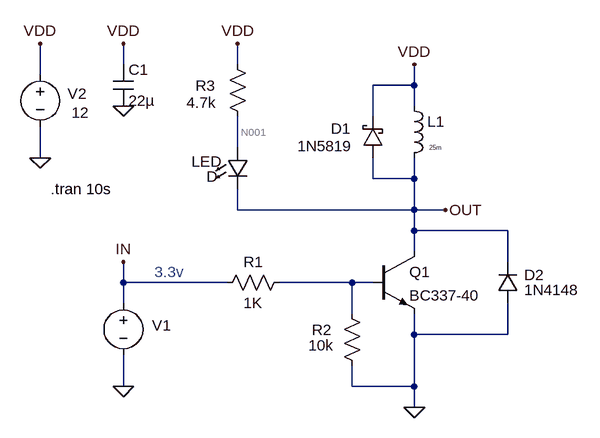
[diagram p0: schematic v1.1.asc]
v1.1.asc, the LTspice schematic file:
Version 4.1
SHEET 1 1332 680
WIRE 336 -112 336 -144
WIRE 512 -112 512 -144
WIRE 208 -96 208 -144
WIRE 784 -80 784 -112
WIRE 784 -80 720 -80
WIRE 784 -48 784 -80
WIRE 720 -32 720 -80
WIRE 512 16 512 -32
WIRE 208 32 208 -16
WIRE 720 64 720 32
WIRE 784 64 784 32
WIRE 784 64 720 64
WIRE 512 112 512 80
WIRE 784 112 784 64
WIRE 784 112 512 112
WIRE 832 112 784 112
WIRE 784 144 784 112
WIRE 928 144 784 144
WIRE 784 176 784 144
WIRE 928 192 928 144
WIRE 336 224 336 192
WIRE 496 224 336 224
WIRE 688 224 576 224
WIRE 720 224 688 224
WIRE 336 256 336 224
WIRE 688 272 688 224
WIRE 784 304 784 272
WIRE 928 304 928 256
WIRE 928 304 784 304
WIRE 336 384 336 336
WIRE 688 384 688 352
WIRE 784 384 784 304
WIRE 784 384 688 384
WIRE 784 416 784 384
FLAG 336 384 0
FLAG 208 32 0
FLAG 336 192 IN
FLAG 784 416 0
FLAG 208 -144 VDD
FLAG 784 -112 VDD
FLAG 832 112 OUT
FLAG 512 -144 VDD
FLAG 336 -48 0
FLAG 336 -144 VDD
SYMBOL voltage 336 240 R0
WINDOW 123 0 0 Left 0
WINDOW 39 0 0 Left 0
WINDOW 0 44 50 Left 2
WINDOW 3 43 83 Invisible 2
SYMATTR InstName V1
SYMATTR Value PULSE(0 3.3 2 1n 1n 2 4)
SYMBOL res 592 208 R90
WINDOW 0 0 56 VBottom 2
WINDOW 3 32 56 VTop 2
SYMATTR InstName R1
SYMATTR Value 1K
SYMBOL voltage 208 -112 R0
WINDOW 123 0 0 Left 0
WINDOW 39 0 0 Left 0
WINDOW 0 42 45 Left 2
WINDOW 3 48 74 Left 2
SYMATTR InstName V2
SYMATTR Value 12
SYMBOL npn 720 176 R0
SYMATTR InstName Q1
SYMATTR Value BC337-40
SYMBOL res 672 256 R0
WINDOW 0 -46 41 Left 2
WINDOW 3 -51 65 Left 2
SYMATTR InstName R2
SYMATTR Value 10k
SYMBOL ind 768 -64 R0
WINDOW 3 39 80 Left 0
SYMATTR Value 25m
SYMATTR InstName L1
SYMATTR SpiceLine Rser=120
SYMBOL diode 944 256 R180
WINDOW 0 -40 44 Left 2
WINDOW 3 -94 21 Left 2
SYMATTR InstName D2
SYMATTR Value 1N4148
SYMBOL LED 496 16 R0
WINDOW 0 -55 22 Left 2
WINDOW 3 -32 45 Left 2
SYMATTR InstName LED
SYMBOL res 496 -128 R0
WINDOW 0 -49 49 Left 2
WINDOW 3 -63 75 Left 2
SYMATTR InstName R3
SYMATTR Value 4.7k
SYMBOL schottky 736 32 R180
WINDOW 0 50 45 Left 2
WINDOW 3 47 18 Left 2
SYMATTR InstName D1
SYMATTR Value 1N5819
SYMBOL cap 320 -112 R0
SYMATTR InstName C1
SYMATTR Value 22µ
TEXT 224 80 Left 2 !.tran 10s
TEXT 384 208 Left 2 ;3.3v

The netlist it stands for:
* v1.1.asc
V1 IN 0 PULSE(0 3.3 2 1n 1n 2 4)
R1 N002 IN 1K
V2 VDD 0 12
Q1 OUT N002 0 0 BC337-40
R2 N002 0 10k
L1 VDD OUT 25m Rser=120
D2 0 OUT 1N4148
D§LED N001 OUT D
R3 VDD N001 4.7k
D1 OUT VDD 1N5819
C1 VDD 0 22µ
.model D D
.lib standard.dio
.model NPN NPN
.model PNP PNP
.lib standard.bjt
.tran 10s
* 3.3v
.backanno
.end

* Results of the author's LTspice run, read from the files saved beside the schematic
* Operating Point, zero values left out:
*   V(n001) = 12 V
*   V(out) = 12 V
*   V(vdd) = 12 V
*   I(D1) = -246.1 pA
*   I(D2) = -2.532 nA
*   I(L1) = 2.298 nA
*   I(R1) = 10.97 pA
*   I(R2) = 1.097 pA
*   I(V1) = 10.97 pA
*   I(V2) = -2.544 nA
*   Ib(Q1) = -12.07 pA
*   Ic(Q1) = 12.15 pA
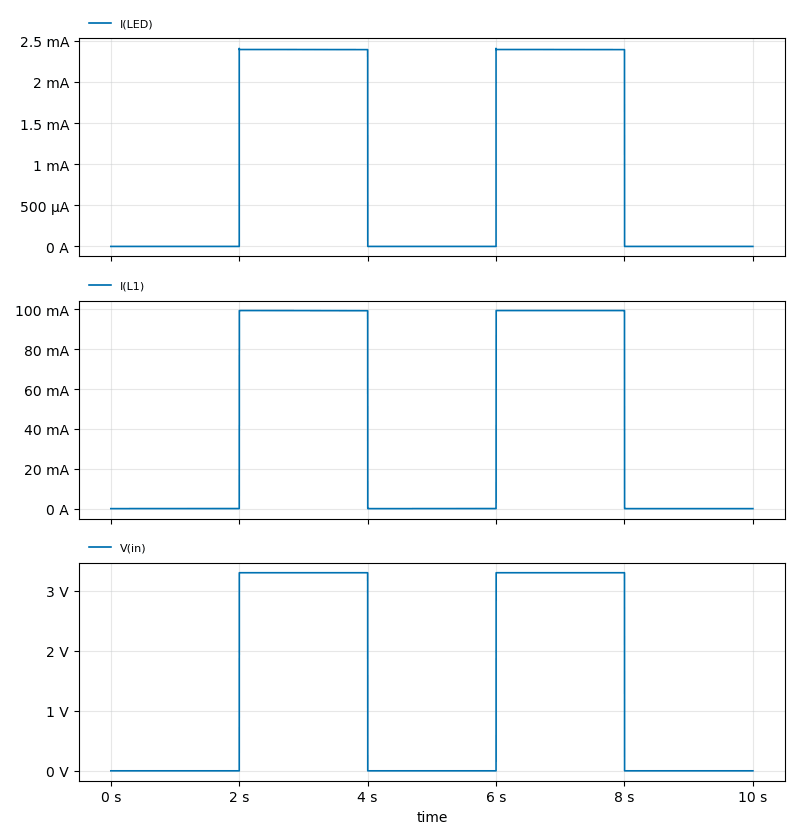
[diagram p1: Transient Analysis of v1.1.asc, plotted from the saved traces]
* Transient Analysis, 1 run:
*   I(LED): min 0 A, max 2.408 mA, average 957.5 µA, rms 1.514 mA, last 0 A
*   I(L1): min 0 A, max 99.41 mA, average 39.76 mA, rms 62.86 mA, last 0 A
*   V(in): min 0 V, max 3.3 V, average 1.32 V, rms 2.087 V, last 0 V